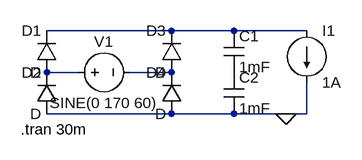
[diagram p0: schematic HW2q5.asc]
HW2q5.asc, the LTspice schematic file:
Version 4.1
SHEET 1 880 680
WIRE 224 96 32 96
WIRE 320 96 224 96
WIRE 432 96 320 96
WIRE 80 160 32 160
WIRE 224 160 160 160
WIRE 224 224 32 224
WIRE 320 224 224 224
WIRE 400 224 320 224
WIRE 432 224 432 176
WIRE 432 224 400 224
FLAG 400 224 0
SYMBOL voltage 64 160 R270
WINDOW 0 32 56 VTop 2
WINDOW 3 -32 56 VBottom 2
WINDOW 123 0 0 Left 0
WINDOW 39 0 0 Left 0
SYMATTR InstName V1
SYMATTR Value SINE(0 170 60)
SYMBOL diode 48 160 R180
WINDOW 0 24 64 Left 2
WINDOW 3 24 0 Left 2
SYMATTR InstName D1
SYMBOL diode 48 224 R180
WINDOW 0 24 64 Left 2
WINDOW 3 24 0 Left 2
SYMATTR InstName D2
SYMBOL diode 240 160 R180
WINDOW 0 24 64 Left 2
WINDOW 3 24 0 Left 2
SYMATTR InstName D3
SYMBOL diode 240 224 R180
WINDOW 0 24 64 Left 2
WINDOW 3 24 0 Left 2
SYMATTR InstName D4
SYMBOL cap 304 96 R0
SYMATTR InstName C1
SYMATTR Value 1mF
SYMBOL cap 304 160 R0
SYMATTR InstName C2
SYMATTR Value 1mF
SYMBOL current 432 96 R0
WINDOW 123 0 0 Left 0
WINDOW 39 0 0 Left 0
SYMATTR InstName I1
SYMATTR Value 1A
TEXT -8 248 Left 2 !.tran 30m

The netlist it stands for:
* HW2q5.asc
V1 N002 N003 SINE(0 170 60)
D1 N002 N001 D
D2 0 N002 D
D3 N003 N001 D
D4 0 N003 D
C1 N001 P001 1mF
C2 P001 0 1mF
I1 N001 0 1A
.model D D
.lib standard.dio
.tran 30m
.backanno
.end